# Altium schematic sheet Block_PhotoDiode.SchDoc: <title>
size A4; Organization: Institut d'Automatisation Industrielle; SheetNumber: 3; SheetTotal: 3; SVN: OUI; CurrentTime: 6; CurrentDate: 5; DocumentFullPathAndName: 8; DocumentName: 9; ModifiedDate: 13; ProjectName: <projet>
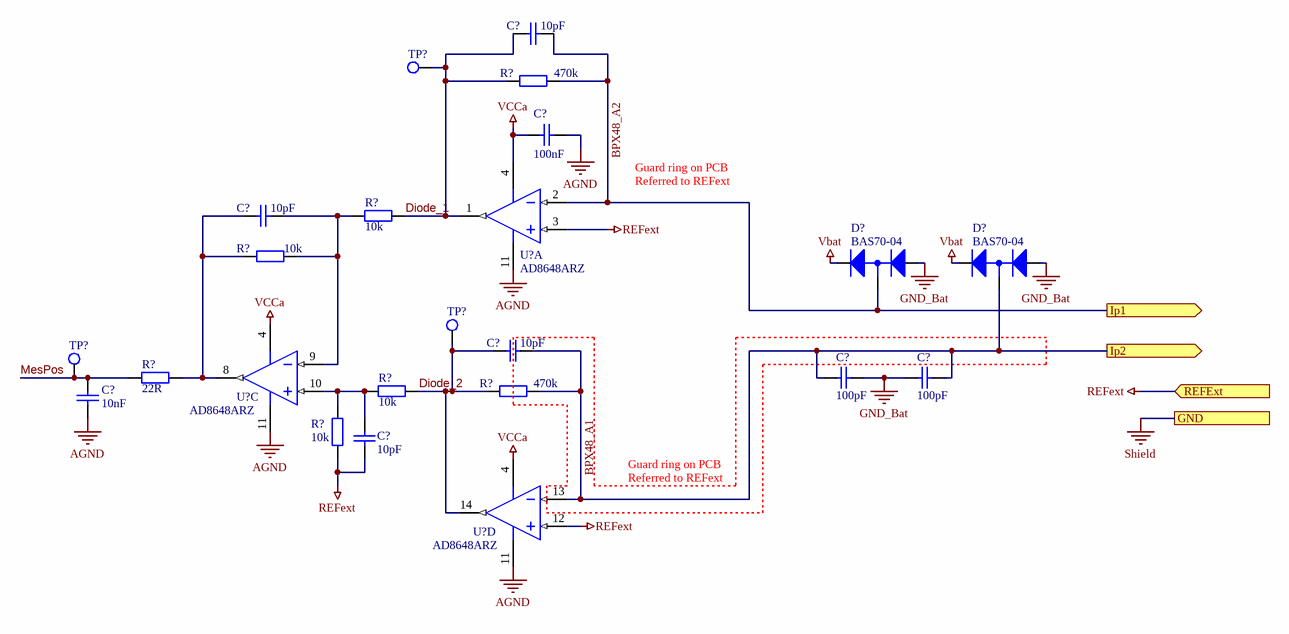
[diagram p0: Block_PhotoDiode.SchDoc]

## Parts
(Parts that share a designator on the sheet are numbered #1, #2 ... from top to bottom, then left to right.)
C?#1  10pF  [CAPC2012N]
C?#2  100nF  [CAPC2012N]
C?#3  10pF  [CAPC2012N]
C?#4  10pF  [CAPC2012N]
C?#5  100pF  [CAPC2012N]
C?#6  100pF  [CAPC2012N]
C?#7  10nF  [CAPC2012N]
C?#8  10pF  [CAPC2012N]
D?#1  BAS70-04  [SOT23-3N]
D?#2  BAS70-04  [SOT23-3N]
R?#1  470k  [RESC2012N]
R?#2  10k  [RESC2012N]
R?#3  10k  [RESC2012N]
R?#4  22R  [RESC2012N]
R?#5  10k  [RESC2012N]
R?#6  470k  [RESC2012N]
R?#7  10k  [RESC2012N]
TP?#1  TP  [Testpoint]  (value not drawn)
TP?#2  TP  [Testpoint]  (value not drawn)
TP?#3  TP  [Testpoint]  (value not drawn)
U?#1  AD8648ARZ  [ADI-R-14_M]  (part A of 4)
U?#2  AD8648ARZ  [ADI-R-14_M]  (part C of 4)
U?#3  AD8648ARZ  [ADI-R-14_M]  (part D of 4)

## Ports
GND, Ip1 (out), Ip2 (out), REFExt (in)

## Nets
AGND: C?#2.1 C?#7.1 U?#1.11(-V) U?#2.11(-V) U?#3.11(-V)
GND_Bat: C?#5.2 C?#6.1 D?#1.1(A) D?#2.1(A)
REFext: C?#8.1 R?#7.1 U?#1.3(+IN_A) U?#3.12(+IN_D) ; port REFExt
Shield: port GND
Vbat: D?#1.2(K) D?#2.2(K)
VCCa: C?#2.2 U?#1.4(+V) U?#2.4(+V) U?#3.4(+V)
BPX48_A1: C?#4.2 C?#5.1 C?#6.2 D?#2.3(A/K) R?#6.2 U?#3.13(-IN_D) ; port Ip2
BPX48_A2: C?#1.2 D?#1.3(A/K) R?#1.2 U?#1.2(-IN_A) ; port Ip1
Diode_1: C?#1.1 R?#1.1 R?#2.2 TP?#1.1 U?#1.1(OUT_A)
Diode_2: C?#4.1 R?#5.2 R?#6.1 TP?#2.1 U?#3.14(OUT_D)
MesPos: C?#7.2 R?#4.1 TP?#3.1
NetC?#3_1: C?#3.1 R?#3.1 R?#4.2 U?#2.8(OUT_C)
NetC?#3_2: C?#3.2 R?#2.1 R?#3.2 U?#2.9(-IN_C)
NetC?#8_2: C?#8.2 R?#5.1 R?#7.2 U?#2.10(+IN_C)

## Notes on the sheet
- Guard ring on PCB
- Referred to REFext
- Title
- Institut d'automatisation industrielle
  rte de Cheseaux 1
  CH-1401 Yverdon-les-Bains
  T +41(0)24 55 77 377    F +41(0)24 55 76 320
  http://iai.heig-vd.ch       iai@heig-vd.ch
- Date:
- Size:
- A4
- Project:
- Sheet
- of
- No.
- Author:
- SVN
- Version
- File:

## Library data of the parts
C?#1 C?#3 C?#4 C?#8 = Cap_10pF: Capacitor; Value: 10pF; Supplier 1: Digi-Key; Supplier Part Number 1: 311-1099-1-ND
C?#2 = Cap_100nF: Capacitor; Value: 100nF; Supplier 1: Digi-Key; Supplier Part Number 1: 478-1395-1-ND
C?#5 C?#6 = Cap_100pF: Capacitor; Value: 100pF; Supplier 1: Digi-Key; Supplier Part Number 1: 399-1122-1-ND
C?#7 = Cap_10nF: Capacitor; Value: 10nF; Supplier 1: Digi-Key; Supplier Part Number 1: 311-1136-1-ND
R?#1 R?#6 = Res_470k: Resistor; Value: 470k; Supplier 1: Digi-Key; Supplier Part Number 1: 311-470KCRCT-ND
R?#2 R?#3 R?#5 R?#7 = Res_10k: Resistor; Value: 10k; Supplier 1: Digi-Key; Supplier Part Number 1: 311-10.0KCRCT-ND
R?#4 = Res_22R: Resistor; Value: 22R; Supplier 1: Digi-Key; Supplier Part Number 1: 311-22.0CRCT-ND
TP?#1-TP?#3 = TP: =Value; Supplier 1: Digi-Key; Supplier Part Number 1: 36-5006-ND
U?#1-U?#3 = AD8648ARZ: Quad Channel Wide Bandwidth Operational Amplifier, 22 MHz BW, 12 V/us SR, Industrial, 14-pin SOIC (R-14), Tube; Generic Part Number: AD8648; Manufacturer: Analog Devices; Amplifiers Per Package: 4; Automotive Qualified: Yes; Input Bias Current: 200fA; Input Offset Voltage: 700uV; Iq/Amp: 2mA; Slew Rate: 12V/us; Small Signal Bandwidth: 22MHz; V Span Max: 5.5V; V Span Min: 2.7V; DatasheetVersion: Rev. D; PackageVersion: 060606-A; PackageReference: R-14; PackageDescription: 14-Pin Standard Small Outline Package, Body 8.65 x 3.9 mm, Pitch 1.27 mm; Mounting Technology: Surface Mount; Code_JEDEC: MS-012-AB; PartNumber: AD8648ARZ; ComponentLink1Description: Manufacturer URL; ComponentLink1URL: http://www.analog.com/en/index.html; ComponentLink2Description: Datasheet; ComponentLink2URL: http://www.analog.com/static/imported-files/data_sheets/AD8646_8647_8648.pdf; ComponentLink3Description: Package Specification; ComponentLink3URL: http://www.analog.com/static/imported-files/packages/PKG_PDF/SOIC_Narrow%20(R)/R_14.pdf; Supplier 1: Digi-Key; Supplier Part Number 1: AD8648ARZ-ND
D?#1 D?#2 = BAS70-04: Supplier 1: Digi-Key; Supplier Part Number 1: BAS70-04-FDICT-ND